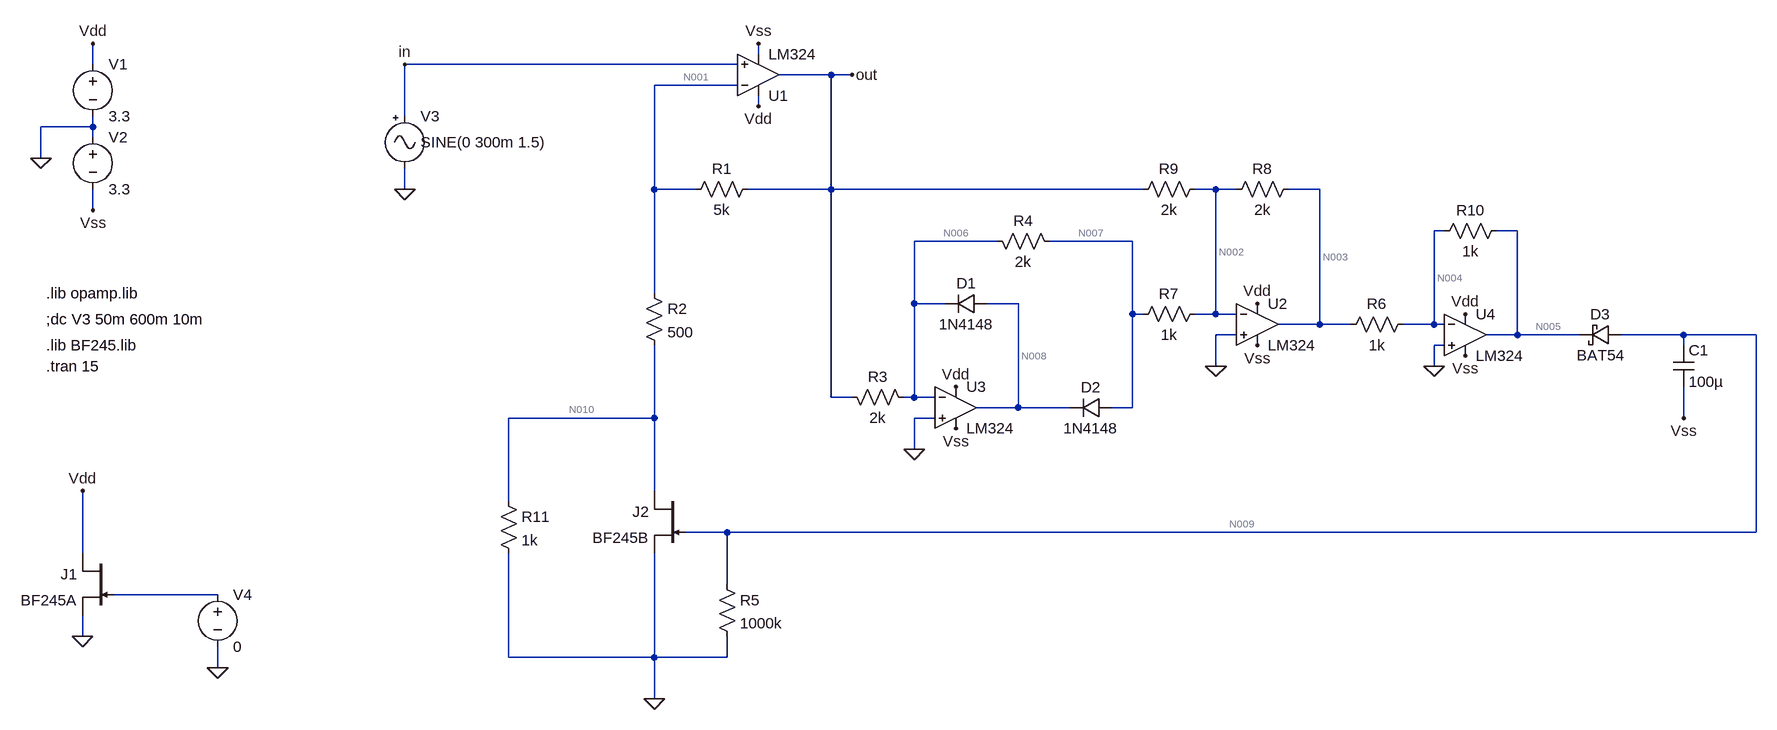
[diagram p0: schematic agc_3.asc]
agc_3.asc, the LTspice schematic file:
Version 4
SHEET 1 1764 940
WIRE 224 -176 224 -192
WIRE -800 -160 -800 -192
WIRE 192 -160 -320 -160
WIRE 336 -144 256 -144
WIRE 368 -144 336 -144
WIRE 192 -128 64 -128
WIRE 224 -96 224 -112
WIRE -320 -80 -320 -160
WIRE -800 -64 -800 -80
WIRE -800 -64 -880 -64
WIRE -800 -48 -800 -64
WIRE -880 -16 -880 -64
WIRE -320 32 -320 0
WIRE 64 32 64 -128
WIRE 128 32 64 32
WIRE 336 32 336 -144
WIRE 336 32 208 32
WIRE 816 32 336 32
WIRE 928 32 896 32
WIRE 960 32 928 32
WIRE 1088 32 1040 32
WIRE -800 64 -800 32
WIRE 1280 96 1264 96
WIRE 1392 96 1360 96
WIRE 592 112 464 112
WIRE 800 112 672 112
WIRE 64 192 64 32
WIRE 464 208 464 112
WIRE 512 208 464 208
WIRE 624 208 576 208
WIRE 800 224 800 112
WIRE 816 224 800 224
WIRE 928 224 928 32
WIRE 928 224 896 224
WIRE 960 224 928 224
WIRE 1088 240 1088 32
WIRE 1088 240 1024 240
WIRE 1136 240 1088 240
WIRE 1264 240 1264 96
WIRE 1264 240 1216 240
WIRE 1280 240 1264 240
WIRE 960 256 928 256
WIRE 1392 256 1392 96
WIRE 1392 256 1344 256
WIRE 1488 256 1392 256
WIRE 1648 256 1552 256
WIRE 1760 256 1648 256
WIRE 1280 272 1264 272
WIRE 1648 272 1648 256
WIRE 928 304 928 256
WIRE 1264 304 1264 272
WIRE 336 352 336 32
WIRE 368 352 336 352
WIRE 464 352 464 208
WIRE 464 352 448 352
WIRE 496 352 464 352
WIRE 624 368 624 208
WIRE 624 368 560 368
WIRE 704 368 624 368
WIRE 800 368 800 224
WIRE 800 368 768 368
WIRE 64 384 64 272
WIRE 64 384 -160 384
WIRE 496 384 464 384
WIRE 1648 384 1648 336
WIRE 464 432 464 384
WIRE 64 496 64 384
WIRE -160 512 -160 384
WIRE 176 560 112 560
WIRE 1760 560 1760 256
WIRE 1760 560 176 560
WIRE -816 592 -816 496
WIRE 176 640 176 560
WIRE -608 656 -768 656
WIRE -816 720 -816 688
WIRE -160 752 -160 592
WIRE 64 752 64 592
WIRE 64 752 -160 752
WIRE 176 752 176 720
WIRE 176 752 64 752
WIRE -608 768 -608 736
WIRE 64 816 64 752
FLAG -880 -16 0
FLAG -800 -192 Vdd
FLAG 224 -96 Vdd
FLAG 224 -192 Vss
FLAG -800 64 Vss
FLAG -320 32 0
FLAG 368 -144 out
FLAG -320 -160 in
FLAG -816 720 0
FLAG -816 496 Vdd
FLAG -608 768 0
FLAG 528 400 Vss
FLAG 528 336 Vdd
FLAG 64 816 0
FLAG 928 304 0
FLAG 992 208 Vdd
FLAG 992 272 Vss
FLAG 1648 384 Vss
FLAG 1312 288 Vss
FLAG 1312 224 Vdd
FLAG 464 432 0
FLAG 1264 304 0
SYMBOL voltage -800 -176 R0
SYMATTR InstName V1
SYMATTR Value 3.3
SYMBOL voltage -800 -64 R0
SYMATTR InstName V2
SYMATTR Value 3.3
SYMBOL Misc\\signal -320 -96 R0
WINDOW 123 24 144 Left 2
WINDOW 39 0 0 Left 2
WINDOW 3 24 56 Left 2
SYMATTR Value SINE(0 300m 1.5)
SYMATTR InstName V3
SYMBOL res 224 16 R90
WINDOW 0 0 56 VBottom 2
WINDOW 3 32 56 VTop 2
SYMATTR InstName R1
SYMATTR Value 5k
SYMBOL njf -768 592 M0
SYMATTR InstName J1
SYMATTR Value BF245A
SYMBOL voltage -608 640 R0
SYMATTR InstName V4
SYMATTR Value 0
SYMBOL Opamps\\opamp2 224 -80 M180
SYMATTR InstName U1
SYMATTR Value LM324
SYMBOL Opamps\\opamp2 528 304 R0
SYMATTR InstName U3
SYMATTR Value LM324
SYMBOL diode 768 384 M270
WINDOW 0 32 32 VTop 2
WINDOW 3 0 32 VBottom 2
SYMATTR InstName D2
SYMATTR Value 1N4148
SYMBOL njf 112 496 M0
SYMATTR InstName J2
SYMATTR Value BF245B
SYMBOL res 48 176 R0
SYMATTR InstName R2
SYMATTR Value 500
SYMBOL res 160 624 R0
SYMATTR InstName R5
SYMATTR Value 1000k
SYMBOL diode 576 224 M270
WINDOW 0 32 32 VTop 2
WINDOW 3 0 32 VBottom 2
SYMATTR InstName D1
SYMATTR Value 1N4148
SYMBOL res 464 368 M270
WINDOW 0 32 56 VTop 2
WINDOW 3 0 56 VBottom 2
SYMATTR InstName R3
SYMATTR Value 2k
SYMBOL res 688 128 M270
WINDOW 0 32 56 VTop 2
WINDOW 3 0 56 VBottom 2
SYMATTR InstName R4
SYMATTR Value 2k
SYMBOL Opamps\\opamp2 992 176 R0
SYMATTR InstName U2
SYMATTR Value LM324
SYMBOL res 912 208 R90
WINDOW 0 0 56 VBottom 2
WINDOW 3 32 56 VTop 2
SYMATTR InstName R7
SYMATTR Value 1k
SYMBOL res 1056 16 R90
WINDOW 0 0 56 VBottom 2
WINDOW 3 32 56 VTop 2
SYMATTR InstName R8
SYMATTR Value 2k
SYMBOL res 912 16 R90
WINDOW 0 0 56 VBottom 2
WINDOW 3 32 56 VTop 2
SYMATTR InstName R9
SYMATTR Value 2k
SYMBOL cap 1632 272 R0
SYMATTR InstName C1
SYMATTR Value 100µ
SYMBOL Opamps\\opamp2 1312 192 R0
SYMATTR InstName U4
SYMATTR Value LM324
SYMBOL schottky 1552 240 R90
WINDOW 0 0 32 VBottom 2
WINDOW 3 32 32 VTop 2
SYMATTR InstName D3
SYMATTR Value BAT54
SYMATTR Description Diode
SYMATTR Type diode
SYMBOL res 1232 224 R90
WINDOW 0 0 56 VBottom 2
WINDOW 3 32 56 VTop 2
SYMATTR InstName R6
SYMATTR Value 1k
SYMBOL res 1376 80 R90
WINDOW 0 0 56 VBottom 2
WINDOW 3 32 56 VTop 2
SYMATTR InstName R10
SYMATTR Value 1k
SYMBOL res -176 496 R0
SYMATTR InstName R11
SYMATTR Value 1k
TEXT -872 232 Left 2 !;dc V3 50m 600m 10m
TEXT -872 192 Left 2 !.lib opamp.lib
TEXT -872 272 Left 2 !.lib BF245.lib
TEXT -872 304 Left 2 !.tran 15

The netlist it stands for:
* agc_3.asc
V1 Vdd 0 3.3
V2 0 Vss 3.3
V3 in 0 SINE(0 300m 1.5)
R1 out N001 5k
J1 Vdd N011 0 BF245A
V4 N011 0 0
XU1 in N001 Vdd Vss out LM324  ; pins In+ In- V+ V- OUT
XU3 0 N006 Vdd Vss N008 LM324  ; pins In+ In- V+ V- OUT
D2 N007 N008 1N4148
J2 N010 N009 0 BF245B
R2 N001 N010 500
R5 N009 0 1000k
D1 N008 N006 1N4148
R3 N006 out 2k
R4 N007 N006 2k
XU2 0 N002 Vdd Vss N003 LM324  ; pins In+ In- V+ V- OUT
R7 N002 N007 1k
R8 N003 N002 2k
R9 N002 out 2k
C1 N009 Vss 100µ
XU4 0 N004 Vdd Vss N005 LM324  ; pins In+ In- V+ V- OUT
D3 N009 N005 BAT54
R6 N004 N003 1k
R10 N005 N004 1k
R11 N010 0 1k
.model D D
.lib standard.dio
.model NJF NJF
.model PJF PJF
.lib standard.jft
;dc V3 50m 600m 10m
.lib opamp.lib
.lib BF245.lib
.tran 15
.backanno
.end

* Results of the author's LTspice run, read from the files saved beside the schematic
* Operating Point, zero values left out:
*   V(vdd) = 3.3 V
*   V(vss) = -3.3 V
*   V(out) = -1.84 mV
*   V(n001) = -192.5 µV
*   V(n008) = 259.6 mV
*   V(n006) = -195.1 µV
*   V(n007) = -191.7 µV
*   V(n010) = -50.22 µV
*   V(n009) = -1.427 mV
*   V(n003) = 1.363 mV
*   V(n002) = -192.5 µV
*   V(n005) = -1.793 mV
*   V(n004) = -192.5 µV
*   I(D3) = 1.427 nA
*   I(D1) = 775.8 nA
*   I(D2) = -2.512 nA
*   Id(J2) = -234.3 nA
*   Is(J2) = 234.3 nA
*   Id(J1) = 3.584 mA
*   Ig(J1) = -3.3 pA
*   Is(J1) = -3.584 mA
*   I(R11) = -50.22 nA
*   I(R10) = -1.601 µA
*   I(R6) = -1.556 µA
*   I(R9) = 823.8 nA
*   I(R8) = 778 nA
*   I(R7) = -812.8 pA
*   I(R4) = 1.699 nA
*   I(R3) = 822.5 nA
*   I(R5) = -1.427 nA
*   I(R2) = -284.6 nA
*   I(R1) = -329.5 nA
*   I(V4) = 3.3 pA
*   I(V3) = 44.74 nA
*   I(V2) = -2.972 mA
*   I(V1) = -6.556 mA
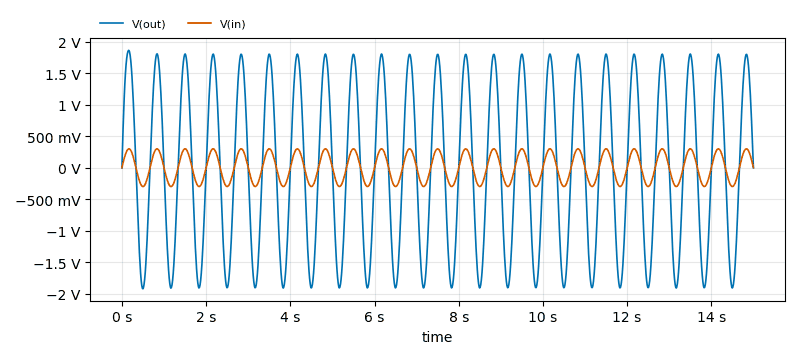
[diagram p1: Transient Analysis of agc_3.asc, plotted from the saved traces]
* Transient Analysis, 1 run:
*   V(out): min -1.92 V, max 1.86 V, average 507.4 µV, rms 1.312 V, last -1.404 mV
*   V(in): min -299.3 mV, max 299.3 mV, average 4.214 mV, rms 211.1 mV, last 0 V